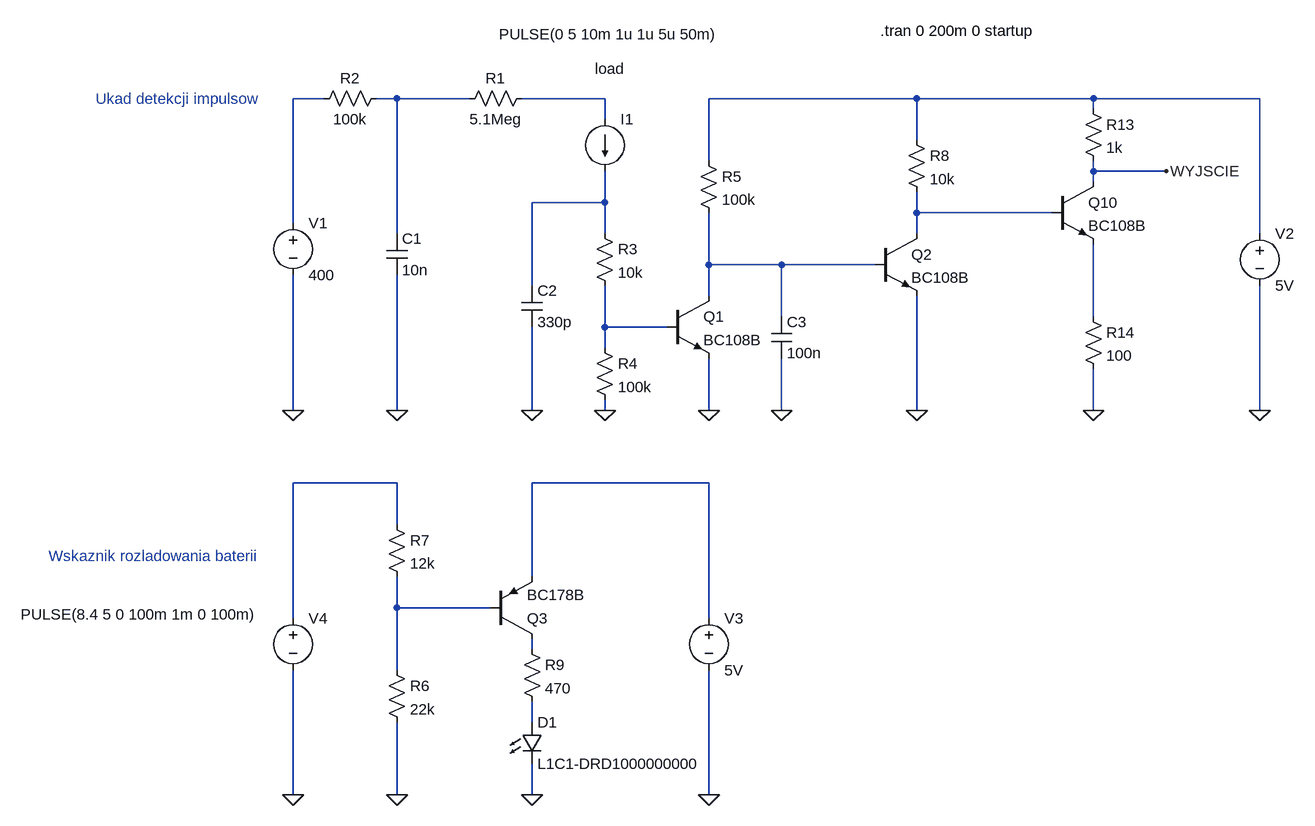
[diagram p0: schematic dodatkowe.asc]
dodatkowe.asc, the LTspice schematic file:
Version 4
SHEET 1 1592 1860
WIRE -32 32 -80 32
WIRE 80 32 48 32
WIRE 192 32 80 32
WIRE 400 32 272 32
WIRE 880 32 560 32
WIRE 1152 32 880 32
WIRE 1408 32 1152 32
WIRE 1152 48 1152 32
WIRE 400 64 400 32
WIRE 880 96 880 32
WIRE 560 128 560 32
WIRE 1152 144 1152 128
WIRE 1264 144 1152 144
WIRE 1152 160 1152 144
WIRE 400 192 400 144
WIRE 400 192 288 192
WIRE 880 208 880 176
WIRE 1088 208 880 208
WIRE -80 224 -80 32
WIRE 80 240 80 32
WIRE 400 240 400 192
WIRE 880 240 880 208
WIRE 1408 240 1408 32
WIRE 560 288 560 208
WIRE 672 288 560 288
WIRE 816 288 672 288
WIRE 288 320 288 192
WIRE 560 336 560 288
WIRE 672 368 672 288
WIRE 1152 368 1152 256
WIRE 400 384 400 320
WIRE 496 384 400 384
WIRE 400 416 400 384
WIRE -80 512 -80 304
WIRE 80 512 80 304
WIRE 288 512 288 384
WIRE 400 512 400 496
WIRE 560 512 560 432
WIRE 672 512 672 432
WIRE 880 512 880 336
WIRE 1152 512 1152 448
WIRE 1408 512 1408 320
WIRE 80 624 -80 624
WIRE 560 624 288 624
WIRE 80 688 80 624
WIRE 288 768 288 624
WIRE 80 816 80 768
WIRE 224 816 80 816
WIRE -80 832 -80 624
WIRE 560 832 560 624
WIRE 288 880 288 864
WIRE 80 912 80 816
WIRE 288 992 288 960
WIRE -80 1104 -80 912
WIRE 80 1104 80 992
WIRE 288 1104 288 1056
WIRE 560 1104 560 912
FLAG -80 512 0
FLAG 400 512 0
FLAG 80 512 0
FLAG 288 512 0
FLAG 560 512 0
FLAG 672 512 0
FLAG 1408 512 0
FLAG 880 512 0
FLAG 560 1104 0
FLAG 288 1104 0
FLAG 80 1104 0
FLAG -80 1104 0
FLAG 1152 512 0
FLAG 1264 144 WYJSCIE
SYMBOL voltage -80 208 R0
WINDOW 123 0 0 Left 0
WINDOW 39 0 0 Left 0
SYMATTR InstName V1
SYMATTR Value 400
SYMBOL res 288 16 R90
WINDOW 0 0 56 VBottom 2
WINDOW 3 32 56 VTop 2
SYMATTR InstName R1
SYMATTR Value 5.1Meg
SYMBOL current 400 64 R0
WINDOW 3 -163 -131 Left 2
WINDOW 123 0 0 Left 0
WINDOW 39 -15 -78 Left 2
SYMATTR Value PULSE(0 5 10m 1u 1u 5u 50m)
SYMATTR SpiceLine load
SYMATTR InstName I1
SYMBOL res 64 16 R90
WINDOW 0 0 56 VBottom 2
WINDOW 3 32 56 VTop 2
SYMATTR InstName R2
SYMATTR Value 100k
SYMBOL cap 64 240 R0
SYMATTR InstName C1
SYMATTR Value 10n
SYMBOL res 384 400 R0
SYMATTR InstName R4
SYMATTR Value 100k
SYMBOL cap 272 320 R0
SYMATTR InstName C2
SYMATTR Value 330p
SYMBOL npn 496 336 R0
SYMATTR InstName Q1
SYMATTR Value BC108B
SYMBOL res 544 112 R0
SYMATTR InstName R5
SYMATTR Value 100k
SYMBOL voltage 1408 224 R0
WINDOW 123 0 0 Left 0
WINDOW 39 0 0 Left 0
SYMATTR InstName V2
SYMATTR Value 5V
SYMBOL cap 656 368 R0
SYMATTR InstName C3
SYMATTR Value 100n
SYMBOL npn 816 240 R0
SYMATTR InstName Q2
SYMATTR Value BC108B
SYMBOL res 864 80 R0
SYMATTR InstName R8
SYMATTR Value 10k
SYMBOL res 384 224 R0
SYMATTR InstName R3
SYMATTR Value 10k
SYMBOL voltage 560 816 R0
WINDOW 123 0 0 Left 0
WINDOW 39 0 0 Left 0
SYMATTR InstName V3
SYMATTR Value 5V
SYMBOL pnp 224 864 M180
SYMATTR InstName Q3
SYMATTR Value BC178B
SYMBOL LED 272 992 R0
SYMATTR InstName D1
SYMATTR Value L1C1-DRD1000000000
SYMBOL res 64 896 R0
SYMATTR InstName R6
SYMATTR Value 22k
SYMBOL voltage -80 816 R0
WINDOW 3 -419 10 Left 2
WINDOW 123 0 0 Left 0
WINDOW 39 0 0 Left 0
SYMATTR Value PULSE(8.4 5 0 100m 1m 0 100m)
SYMATTR InstName V4
SYMBOL res 64 672 R0
SYMATTR InstName R7
SYMATTR Value 12k
SYMBOL res 272 864 R0
SYMATTR InstName R9
SYMATTR Value 470
SYMBOL npn 1088 160 R0
SYMATTR InstName Q10
SYMATTR Value BC108B
SYMBOL res 1136 32 R0
SYMATTR InstName R13
SYMATTR Value 1k
SYMBOL res 1136 352 R0
SYMATTR InstName R14
SYMATTR Value 100
TEXT 824 -72 Left 2 !.tran 0 200m 0 startup
TEXT -384 32 Left 2 ;Ukad detekcji impulsow
TEXT -456 736 Left 2 ;Wskaznik rozladowania baterii

The netlist it stands for:
* dodatkowe.asc
V1 N001 0 400
R1 N003 N002 5.1Meg
I1 N003 N005 PULSE(0 5 10m 1u 1u 5u 50m) load
R2 N002 N001 100k
C1 N002 0 10n
R4 N009 0 100k
C2 N005 0 330p
Q1 N007 N009 0 0 BC108B
R5 N004 N007 100k
V2 N004 0 5V
C3 N007 0 100n
Q2 N006 N007 0 0 BC108B
R8 N004 N006 10k
R3 N005 N009 10k
V3 N011 0 5V
Q3 N013 N012 N011 0 BC178B
D1 N014 0 L1C1-DRD1000000000
R6 N012 0 22k
V4 N010 0 PULSE(8.4 5 0 100m 1m 0 100m)
R7 N010 N012 12k
R9 N013 N014 470
Q10 WYJSCIE N006 N008 0 BC108B
R13 N004 WYJSCIE 1k
R14 N008 0 100
.model D D
.lib standard.dio
.model NPN NPN
.model PNP PNP
.lib standard.bjt
.tran 0 200m 0 startup
* Ukad detekcji impulsow
* Wskaznik rozladowania baterii
.backanno
.end